# EAGLE design mtsch (EAGLE 7.6.0)
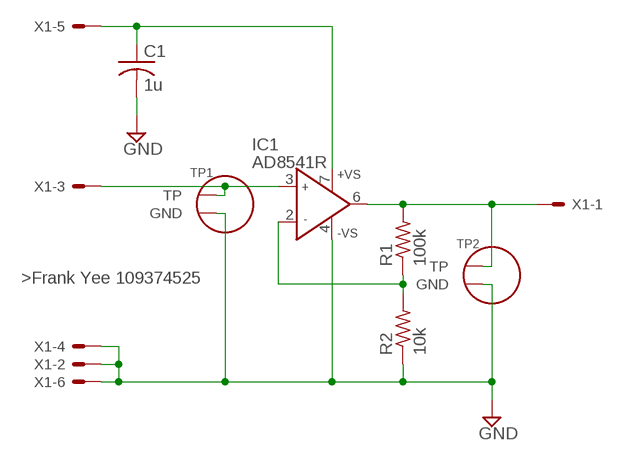
[diagram p0: schematic, sheet 1]

## Parts
C1  1u  C-USC3216  [C3216]
IC1  AD8541R  [SO8]
R1  100k  R-US_M2012  [M2012]
R2  10k  R-US_M2012  [M2012]
TP1  TESTPOINT  [TPXPACK]
TP2  TESTPOINT  [TPXPACK]
X1  22-23-2061  [22-23-2061]

## Nets
GND: C1.2 IC1.4(-VS) R2.1 TP1.GND TP2.GND X1.2 X1.4 X1.6
N$1: C1.1 IC1.7(+VS) X1.5
N$3: IC1.3(IN+) TP1.TP X1.3
N$5: IC1.6(OUT) R1.2 TP2.TP X1.1
N$6: IC1.2(IN-) R1.1 R2.2

## Notes on the sheet
- >Frank Yee 109374525

## Library data of the parts
C1 = resistor:C-US: CAPACITOR, American symbol
IC1 = analog-devices:AD8541: General-Purpose CMOS Rail-to-Rail Amplifiers Source: http://www.analog.com/static/imported-files/data_sheets/AD8541_8542_8544.pdf; MPN: AD8541ARZ; OC_FARNELL: 9603859; OC_NEWARK: 31M4547
R1 R2 = resistor:R-US_: RESISTOR, American symbol
TP1 TP2 = midterm1:TESTPOINT
X1 = con-molex:22-23-2061: .100" (2.54mm) Center Header - 6 Pin; MF: MOLEX; MPN: 22-23-2061; OC_FARNELL: 1462922; OC_NEWARK: 27C1933

## Board
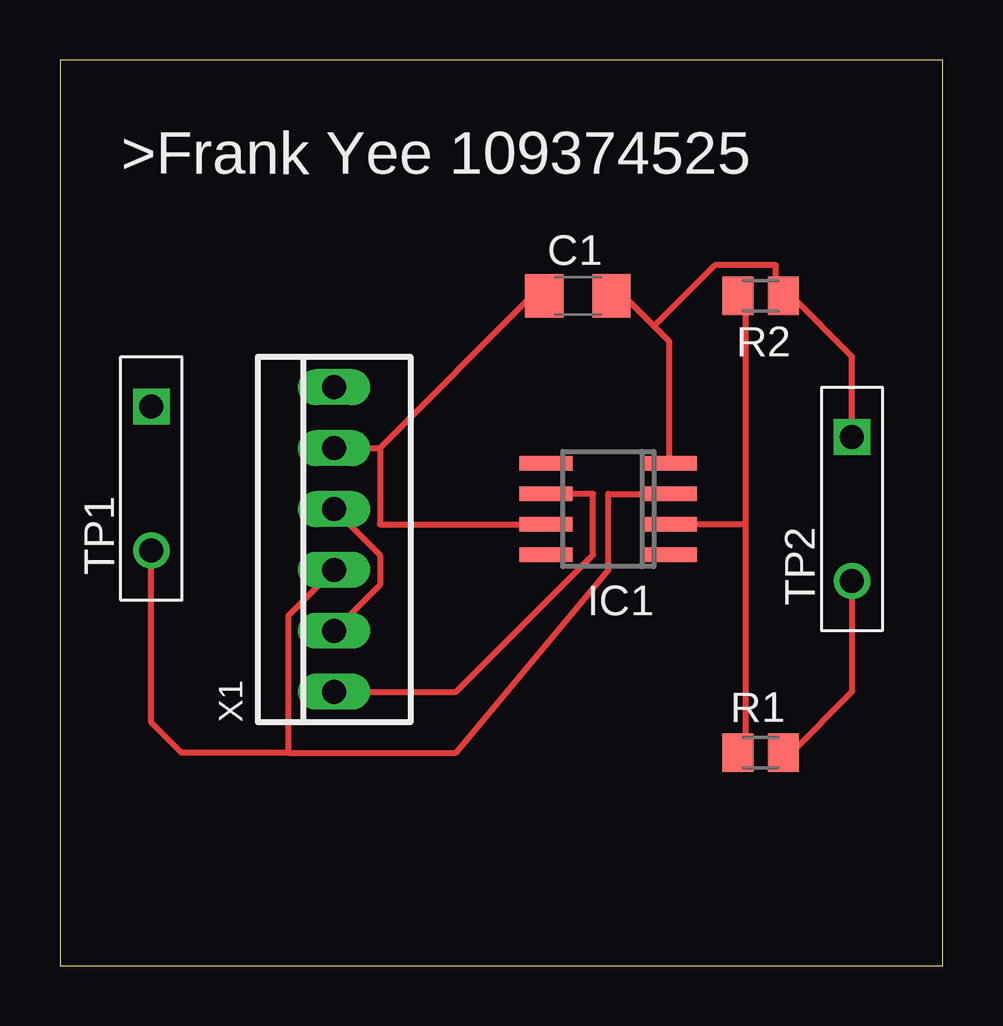
[diagram p1: board, top side]
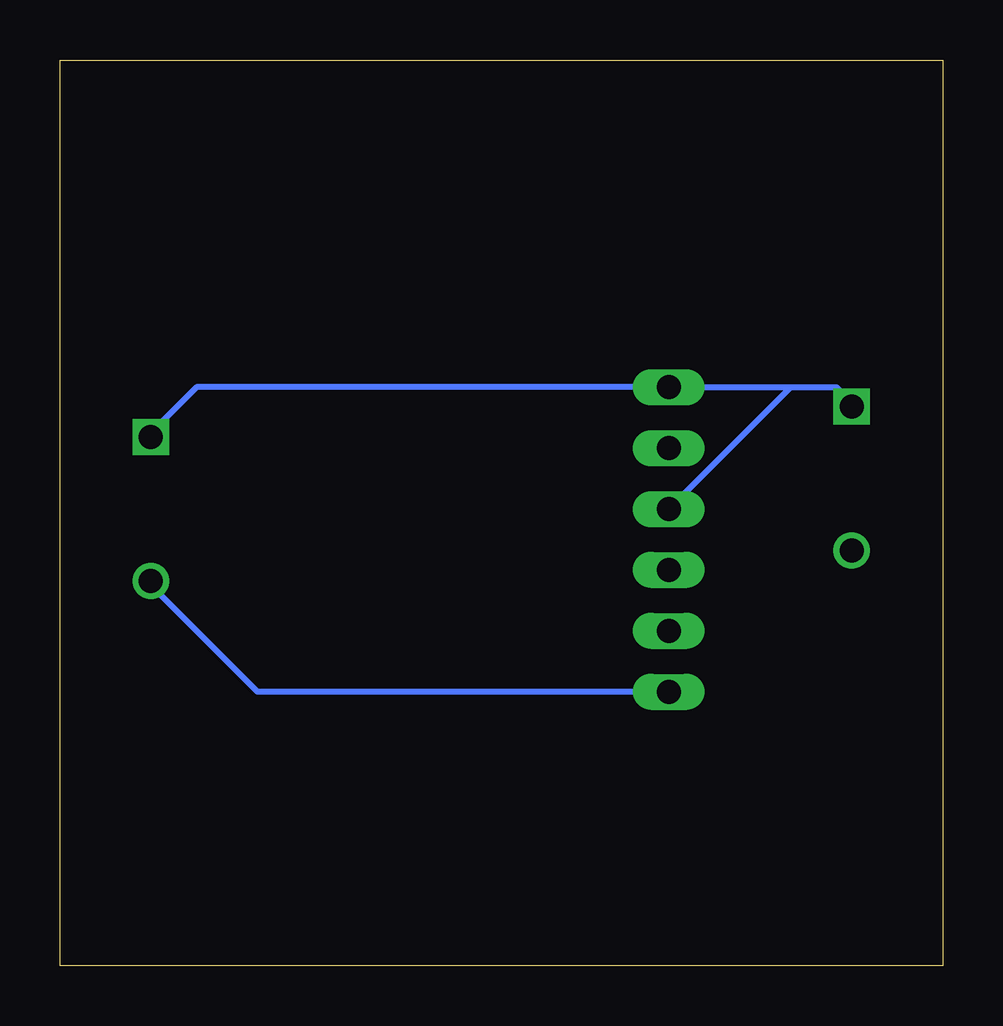
[diagram p2: board, bottom side, seen from below]

Size 36.81 x 37.77 mm. Coordinates in mm from the lower left corner, seen from the top.
Outline: 0,0 36.81,0 36.81,37.77 0,37.77 0,0
Copper layers (1*16): Top 0.035mm / dielectric 1.5mm / Bottom 0.035mm
Design rules "default": minimum track width 10mil, minimum drill 24mil, track to track 8mil, track to pad 8mil, pad to pad 8mil, via to via 8mil, smd to smd 8mil, copper to edge 40mil, drill to drill 8mil, minimum pad ring 10mil, minimum via ring 8mil, stop-mask expansion 4mil, vias tented up to drill 0mil, thermal gap 10mil

### Footprints (pad centres in the part's own frame; a part is rotated, then mirrored left to right if it is on the bottom)
C3216 = smd 1.6 x 1.8: 1 -1.4,0; 2 1.4,0
SO8 = smd 0.6 x 2.2: 1 -1.905,-2.6; 2 -0.635,-2.6; 3 0.635,-2.6; 4 1.905,-2.6; 5 1.905,2.6; 6 0.635,2.6; 7 -0.635,2.6; 8 -1.905,2.6
M2012 = smd 1.3 x 1.6: 1 -0.95,0; 2 0.95,0
TPXPACK = drill 1 square: GND 3,0 | drill 1: TP -3,0
22-23-2061 = drill 1 long: 1 -6.35,0; 2 -3.81,0; 3 -1.27,0; 4 1.27,0; 5 3.81,0; 6 6.35,0

### Placement (x,y rotation side)
C1  21.59,27.94 0 top
IC1  22.86,19.05 90 top
R1  29.21,8.89 0 top
R2  29.21,27.94 180 top
TP1  3.81,20.32 90 top
TP2  33.02,19.05 90 top
X1  11.43,17.78 90 top

### Tracks (layer width: path | path; a pad name or v marks a point on that pad's centre or on a via)
GND
  Top 0.254: 24.77,26.67 25.4,26.04 25.4,20.95 IC1.4 | 24.77,26.67 23.5,27.94 C1.2 | TP2.GND 33.02,25.4 30.48,27.94 R2.1 29.84,27.94 29.84,29.21 27.3,29.21 24.77,26.67 | X1.2 13.34,15.88 13.34,17.14 X1.4
  Bottom 0.254: 6.35,24.13 X1.6 31.11,24.13 33.02,22.23 TP2.GND | 6.35,24.13 4.45,24.13 3.81,23.5 TP1.GND | 6.35,24.13 X1.4
N$1
  Top 0.254: 13.34,21.59 19.68,27.94 C1.1 | X1.5 13.34,21.59 | IC1.7 13.34,18.41 13.34,21.59
N$3
  Top 0.254: IC1.3 22.86,19.68 22.86,16.51 16.51,8.89 9.53,8.89 | X1.3 9.53,14.61 9.53,8.89 | 9.53,8.89 5.08,8.89 3.81,10.16 TP1.TP
N$5
  Top 0.254: TP2.TP 33.02,11.43 30.48,8.89 R1.2 | IC1.6 22.23,19.68 22.23,17.14 16.51,11.43 X1.1
  Bottom 0.254: X1.1 28.57,11.43 33.02,15.88 TP2.TP
N$6
  Top 0.254: 28.57,18.41 28.57,27.94 R2.2 | 28.57,18.41 28.57,8.89 R1.1 | 28.57,18.41 IC1.2

### Text on the board
tPlace: >Frank Yee 109374525